# Altium schematic sheet SHDN-S10-V00-ShutdownSense.SchDoc: Shutdown Loop Sensing & Amplification
size A3; DrawnBy: Jonn Dillon; DocumentNumber: 10; SheetNumber: 10; SheetTotal: 11; Project: Shutdown Board 2020
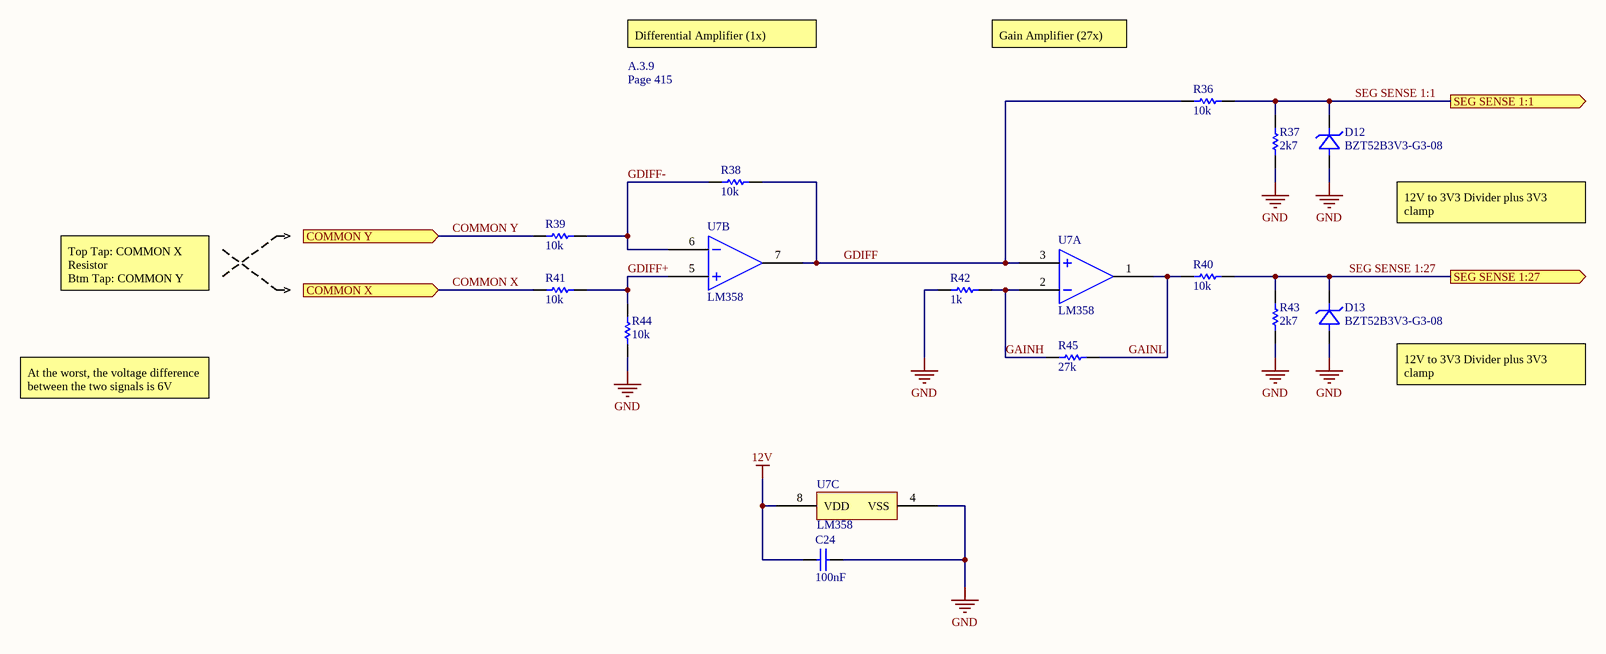
[diagram p0: SHDN-S10-V00-ShutdownSense.SchDoc]

## Parts
C24  100nF  [Cap_Ceramic_0603]
D12  BZT52B3V3-G3-08  [SOD123]
D13  BZT52B3V3-G3-08  [SOD123]
R36  10k  [Res_ThinFilm_0603]
R37  2k7  [Res_ThinFilm_0603]
R38  10k  [Res_ThinFilm_0603]
R39  10k  [Res_ThinFilm_0603]
R40  10k  [Res_ThinFilm_0603]
R41  10k  [Res_ThinFilm_0603]
R42  1k  [Res_ThinFilm_0603]
R43  2k7  [Res_ThinFilm_0603]
R44  10k  [Res_ThinFilm_0603]
R45  27k  [Res_ThinFilm_0603]
U7  LM358  [TSSOP-8]  (parts A,B,C of 3)

## Ports
COMMON X (in), COMMON Y (in), SEG SENSE 1:1 (out), SEG SENSE 1:27 (out)

## Nets
12V: C24.1 U7.8(VDD)
GND: C24.2 D12.A(Anode) D13.A(Anode) R37.1 R42.1 R43.1 R44.1 U7.4(VSS)
COMMON X: R41.1 ; port COMMON X
COMMON Y: R39.1 ; port COMMON Y
GAINH: R42.2 R45.1 U7.2(IN1-)
GAINL: R40.1 R45.2 U7.1(OUT1)
GDIFF: R36.1 R38.2 U7.3(IN1+) U7.7(OUT1)
GDIFF+: R41.2 R44.2 U7.5(IN2+)
GDIFF-: R38.1 R39.2 U7.6(IN2-)
SEG SENSE 1:1: D12.K(Cathode) R36.2 R37.2 ; port SEG SENSE 1:1
SEG SENSE 1:27: D13.K(Cathode) R40.2 R43.2 ; port SEG SENSE 1:27

## Notes on the sheet
- Differential Amplifier (1x)
- Gain Amplifier (27x)
- A.3.9
- Page 415
- 12V to 3V3 Divider plus 3V3 clamp
- Top Tap: COMMON X
  Resistor
  Btm Tap: COMMON Y
- At the worst, the voltage difference between the two signals is 6V
- Revision History:
- Sheet Title:
- Rev
- Date
- Description
- Project:
- Size:
- Drawn By:
- A3
- Number:
- Revision:
- Sheet
- Version:
- of
- QUT Motorsport
- O-120, Gardens Point
- 2 George Street
- Brisbane, QLD 4000
- Australia
- Print Date:
- Print Time:
- File Name:

## Library data of the parts
C24 = 100nF 50V 5% X7R 0603: Capacitor, Ceramic, SMD, 100nF, 50V, 5%, X7R, 0603
D12 D13 = BZT52B3V3-G3-08: Diode, SMD, Zenner, 3.3V, 2%, 410mW, SOD-123; ComponentLink1Description: Digikey; ComponentLink1URL: https://www.digikey.com.au/product-detail/en/vishay-semiconductor-diodes-division/BZT52B3V3-G3-08/BZT52B3V3-G3-08GICT-ND/8284035; ComponentLink2Description: Datasheet; ComponentLink2URL: https://www.vishay.com/docs/83340/bzt52g.pdf
R36 R38-R41 R44 = 10k 5% 0603: Resistor, SMD, 10k, 0.1W, 5%, 0603
R37 R43 = 2k7 5% 0603: Resistor, SMD, 2k7, 0.1W, 5%, 0603
R42 = 1k 5% 0603: Resistor, SMD, 1k, 0.1W, 5%, 0603
R45 = 27k 5% 0603: Resistor, SMD, 27k, 0.1W, 5%, 0603
U7 = LM358: General Purpose Amplifier 2 Circuit 8-SOIC